# Altium project MiniFPGA.PrjPcb
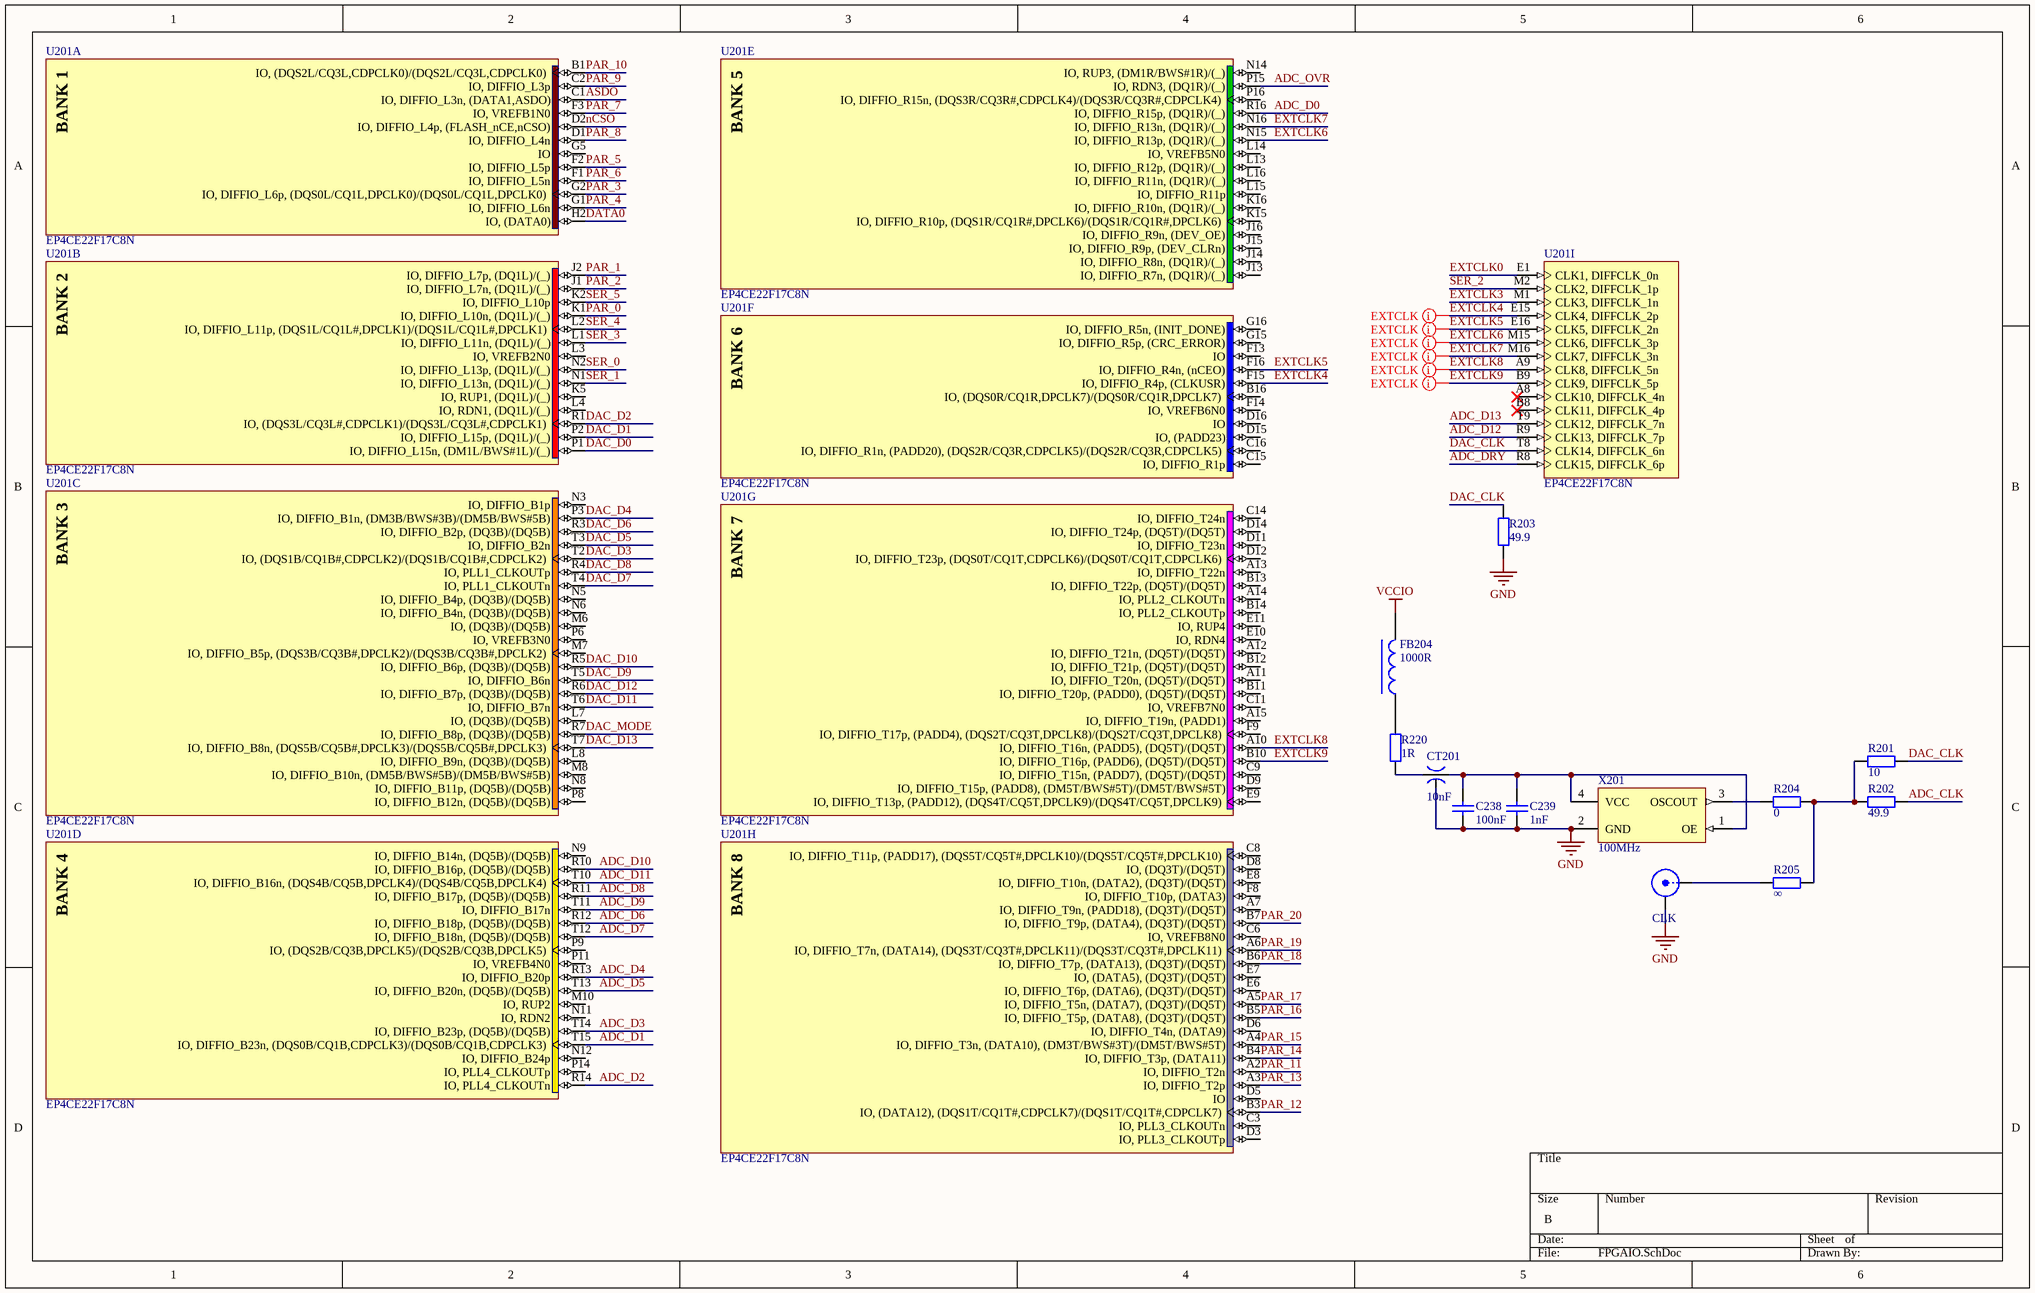
[diagram p0: FPGAIO.SchDoc]
6 sheets, 314 parts. Net scope: global (net labels, ports and power ports of the same name join across sheets).
Board file: MiniFPGA.PcbDoc
Sheets:
  FPGAIO.SchDoc
  FPGAPowerConfig.SchDoc
  ADC.SchDoc
  DAC.SchDoc
  Ports.SchDoc
  Power.SchDoc

## Sheet FPGAIO.SchDoc
size B

### Parts
C238  value 100nF  [0402C]  (hidden comment: MLCC)
C239  value 1nF  [0402C]  (hidden comment: MLCC)
CLK  SMA  [SMA-V-NARROW]  (value not drawn)
CT201  value 10nF  [CAPC0603TH]  (hidden comment: CAP-TH)
FB204  value 1000R  [0603L]  (hidden comment: FerriteBead)
R201  value 10  [0402R]  (hidden comment: Resistor)
R202  value 49.9  [0402R]  (hidden comment: Resistor)
R203  value 49.9  [0402R]  (hidden comment: Resistor)
R204  value 0  [0402R]  (hidden comment: Resistor)
R205  value ∞  [0402R]  (hidden comment: Resistor)
R220  value 1R  [0603R]  (hidden comment: Resistor)
U201  EP4CE22F17C8N  [FBGA256_A-155]  (parts A,B,C,D,E,F,G,H,I of 13)
X201  value 100MHz  [XTAL-7050]  (hidden comment: Oscillator)

### Nets
GND: C238.1 C239.1 CLK.2(Y) CT201.3 R203.1 X201.2(GND)
VCCIO: FB204.2
ADC_CLK: R202.2
ADC_D0: U201.R16(IO,_DIFFIO_R15p,_(DQ1R)/(_))
ADC_D1: U201.T15(IO,_DIFFIO_B23n,_(DQS0B/CQ1B,CDPCLK3)/(DQS0B/CQ1B,CDPCLK3))
ADC_D2: U201.R14(IO,_PLL4_CLKOUTn)
ADC_D3: U201.T14(IO,_DIFFIO_B23p,_(DQ5B)/(DQ5B))
ADC_D4: U201.R13(IO,_DIFFIO_B20p)
ADC_D5: U201.T13(IO,_DIFFIO_B20n,_(DQ5B)/(DQ5B))
ADC_D6: U201.R12(IO,_DIFFIO_B18p,_(DQ5B)/(DQ5B))
ADC_D7: U201.T12(IO,_DIFFIO_B18n,_(DQ5B)/(DQ5B))
ADC_D8: U201.R11(IO,_DIFFIO_B17p,_(DQ5B)/(DQ5B))
ADC_D9: U201.T11(IO,_DIFFIO_B17n)
ADC_D10: U201.R10(IO,_DIFFIO_B16p,_(DQ5B)/(DQ5B))
ADC_D11: U201.T10(IO,_DIFFIO_B16n,_(DQS4B/CQ5B,DPCLK4)/(DQS4B/CQ5B,DPCLK4))
ADC_D12: U201.R9(CLK13,_DIFFCLK_7p)
ADC_D13: U201.T9(CLK12,_DIFFCLK_7n)
ADC_DRY: U201.R8(CLK15,_DIFFCLK_6p)
ADC_OVR: U201.P15(IO,_RDN3,_(DQ1R)/(_))
ASDO: U201.C1(IO,_DIFFIO_L3n,_(DATA1,ASDO))
DAC_CLK: R201.2 R203.2 U201.T8(CLK14,_DIFFCLK_6n)
DAC_D0: U201.P1(IO,_DIFFIO_L15n,_(DM1L/BWS#1L)/(_))
DAC_D1: U201.P2(IO,_DIFFIO_L15p,_(DQ1L)/(_))
DAC_D2: U201.R1(IO,_(DQS3L/CQ3L#,CDPCLK1)/(DQS3L/CQ3L#,CDPCLK1))
DAC_D3: U201.T2(IO,_(DQS1B/CQ1B#,CDPCLK2)/(DQS1B/CQ1B#,CDPCLK2))
DAC_D4: U201.P3(IO,_DIFFIO_B1n,_(DM3B/BWS#3B)/(DM5B/BWS#5B))
DAC_D5: U201.T3(IO,_DIFFIO_B2n)
DAC_D6: U201.R3(IO,_DIFFIO_B2p,_(DQ3B)/(DQ5B))
DAC_D7: U201.T4(IO,_PLL1_CLKOUTn)
DAC_D8: U201.R4(IO,_PLL1_CLKOUTp)
DAC_D9: U201.T5(IO,_DIFFIO_B6n)
DAC_D10: U201.R5(IO,_DIFFIO_B6p,_(DQ3B)/(DQ5B))
DAC_D11: U201.T6(IO,_DIFFIO_B7n)
DAC_D12: U201.R6(IO,_DIFFIO_B7p,_(DQ3B)/(DQ5B))
DAC_D13: U201.T7(IO,_DIFFIO_B8n,_(DQS5B/CQ5B#,DPCLK3)/(DQS5B/CQ5B#,DPCLK3))
DAC_MODE: U201.R7(IO,_DIFFIO_B8p,_(DQ3B)/(DQ5B))
DATA0: U201.H2(IO,_(DATA0))
EXTCLK0: U201.E1(CLK1,_DIFFCLK_0n)
EXTCLK3: U201.M1(CLK3,_DIFFCLK_1n)
EXTCLK4: U201.E15(CLK4,_DIFFCLK_2p) U201.F15(IO,_DIFFIO_R4p,_(CLKUSR))
EXTCLK5: U201.E16(CLK5,_DIFFCLK_2n) U201.F16(IO,_DIFFIO_R4n,_(nCEO))
EXTCLK6: U201.M15(CLK6,_DIFFCLK_3p) U201.N15(IO,_DIFFIO_R13p,_(DQ1R)/(_))
EXTCLK7: U201.M16(CLK7,_DIFFCLK_3n) U201.N16(IO,_DIFFIO_R13n,_(DQ1R)/(_))
EXTCLK8: U201.A9(CLK8,_DIFFCLK_5n) U201.A10(IO,_DIFFIO_T16n,_(PADD5),_(DQ5T)/(DQ5T))
EXTCLK9: U201.B9(CLK9,_DIFFCLK_5p) U201.B10(IO,_DIFFIO_T16p,_(PADD6),_(DQ5T)/(DQ5T))
nCSO: U201.D2(IO,_DIFFIO_L4p,_(FLASH_nCE,nCSO))
PAR_0: U201.K1(IO,_DIFFIO_L10n,_(DQ1L)/(_))
PAR_1: U201.J2(IO,_DIFFIO_L7p,_(DQ1L)/(_))
PAR_2: U201.J1(IO,_DIFFIO_L7n,_(DQ1L)/(_))
PAR_3: U201.G2(IO,_DIFFIO_L6p,_(DQS0L/CQ1L,DPCLK0)/(DQS0L/CQ1L,DPCLK0))
PAR_4: U201.G1(IO,_DIFFIO_L6n)
PAR_5: U201.F2(IO,_DIFFIO_L5p)
PAR_6: U201.F1(IO,_DIFFIO_L5n)
PAR_7: U201.F3(IO,_VREFB1N0)
PAR_8: U201.D1(IO,_DIFFIO_L4n)
PAR_9: U201.C2(IO,_DIFFIO_L3p)
PAR_10: U201.B1(IO,_(DQS2L/CQ3L,CDPCLK0)/(DQS2L/CQ3L,CDPCLK0))
PAR_11: U201.A2(IO,_DIFFIO_T2n)
PAR_12: U201.B3(IO,_(DATA12),_(DQS1T/CQ1T#,CDPCLK7)/(DQS1T/CQ1T#,CDPCLK7))
PAR_13: U201.A3(IO,_DIFFIO_T2p)
PAR_14: U201.B4(IO,_DIFFIO_T3p,_(DATA11))
PAR_15: U201.A4(IO,_DIFFIO_T3n,_(DATA10),_(DM3T/BWS#3T)/(DM5T/BWS#5T))
PAR_16: U201.B5(IO,_DIFFIO_T5p,_(DATA8),_(DQ3T)/(DQ5T))
PAR_17: U201.A5(IO,_DIFFIO_T5n,_(DATA7),_(DQ3T)/(DQ5T))
PAR_18: U201.B6(IO,_DIFFIO_T7p,_(DATA13),_(DQ3T)/(DQ5T))
PAR_19: U201.A6(IO,_DIFFIO_T7n,_(DATA14),_(DQS3T/CQ3T#,DPCLK11)/(DQS3T/CQ3T#,DPCLK11))
PAR_20: U201.B7(IO,_DIFFIO_T9p,_(DATA4),_(DQ3T)/(DQ5T))
SER_0: U201.N2(IO,_DIFFIO_L13p,_(DQ1L)/(_))
SER_1: U201.N1(IO,_DIFFIO_L13n,_(DQ1L)/(_))
SER_2: U201.M2(CLK2,_DIFFCLK_1p)
SER_3: U201.L1(IO,_DIFFIO_L11n,_(DQ1L)/(_))
SER_4: U201.L2(IO,_DIFFIO_L11p,_(DQS1L/CQ1L#,DPCLK1)/(DQS1L/CQ1L#,DPCLK1))
SER_5: U201.K2(IO,_DIFFIO_L10p)
NetC238_2: C238.2 C239.2 CT201.2 X201.1(OE) X201.4(VCC)
NetCLK_1: CLK.1(X) R205.1
NetCT201_1: CT201.1 R220.1
NetFB204_1: FB204.1 R220.2
NetR201_1: R201.1 R202.1 R204.2 R205.2
NetR204_1: R204.1 X201.3(OSCOUT)

Not connected (* = marked no-connect by the designer): U201 A7(IO,_DIFFIO_T9n,_(PADD18),_(DQ3T)/(DQ5T)) A8(CLK10,_DIFFCLK_4n)* A11(IO,_DIFFIO_T20n,_(DQ5T)/(DQ5T)) A12(IO,_DIFFIO_T21n,_(DQ5T)/(DQ5T)) A13(IO,_DIFFIO_T22n) A14(IO,_PLL2_CLKOUTn) A15(IO,_DIFFIO_T19n,_(PADD1)) B8(CLK11,_DIFFCLK_4p)* B11(IO,_DIFFIO_T20p,_(PADD0),_(DQ5T)/(DQ5T)) B12(IO,_DIFFIO_T21p,_(DQ5T)/(DQ5T)) B13(IO,_DIFFIO_T22p,_(DQ5T)/(DQ5T)) B14(IO,_PLL2_CLKOUTp) B16(IO,_(DQS0R/CQ1R,DPCLK7)/(DQS0R/CQ1R,DPCLK7)) C3(IO,_PLL3_CLKOUTn) C6(IO,_VREFB8N0) C8(IO,_DIFFIO_T11p,_(PADD17),_(DQS5T/CQ5T#,DPCLK10)/(DQS5T/CQ5T#,DPCLK10)) C9(IO,_DIFFIO_T15n,_(PADD7),_(DQ5T)/(DQ5T)) C11(IO,_VREFB7N0) C14(IO,_DIFFIO_T24n) C15(IO,_DIFFIO_R1p) C16(IO,_DIFFIO_R1n,_(PADD20),_(DQS2R/CQ3R,CDPCLK5)/(DQS2R/CQ3R,CDPCLK5)) D3(IO,_PLL3_CLKOUTp) D5(IO) D6(IO,_DIFFIO_T4n,_(DATA9)) D8(IO,_(DQ3T)/(DQ5T)) D9(IO,_DIFFIO_T15p,_(PADD8),_(DM5T/BWS#5T)/(DM5T/BWS#5T)) D11(IO,_DIFFIO_T23n) D12(IO,_DIFFIO_T23p,_(DQS0T/CQ1T,CDPCLK6)/(DQS0T/CQ1T,CDPCLK6)) D14(IO,_DIFFIO_T24p,_(DQ5T)/(DQ5T)) D15(IO,_(PADD23)) D16(IO) E6(IO,_DIFFIO_T6p,_(DATA6),_(DQ3T)/(DQ5T)) E7(IO,_(DATA5),_(DQ3T)/(DQ5T)) E8(IO,_DIFFIO_T10n,_(DATA2),_(DQ3T)/(DQ5T)) E9(IO,_DIFFIO_T13p,_(PADD12),_(DQS4T/CQ5T,DPCLK9)/(DQS4T/CQ5T,DPCLK9)) E10(IO,_RDN4) E11(IO,_RUP4) F8(IO,_DIFFIO_T10p,_(DATA3)) F9(IO,_DIFFIO_T17p,_(PADD4),_(DQS2T/CQ3T,DPCLK8)/(DQS2T/CQ3T,DPCLK8)) F13(IO) F14(IO,_VREFB6N0) G5(IO) G15(IO,_DIFFIO_R5p,_(CRC_ERROR)) G16(IO,_DIFFIO_R5n,_(INIT_DONE)) J13(IO,_DIFFIO_R7n,_(DQ1R)/(_)) J14(IO,_DIFFIO_R8n,_(DQ1R)/(_)) J15(IO,_DIFFIO_R9p,_(DEV_CLRn)) J16(IO,_DIFFIO_R9n,_(DEV_OE)) K5(IO,_RUP1,_(DQ1L)/(_)) K15(IO,_DIFFIO_R10p,_(DQS1R/CQ1R#,DPCLK6)/(DQS1R/CQ1R#,DPCLK6)) K16(IO,_DIFFIO_R10n,_(DQ1R)/(_)) L3(IO,_VREFB2N0) L4(IO,_RDN1,_(DQ1L)/(_)) L7(IO,_(DQ3B)/(DQ5B)) L8(IO,_DIFFIO_B9n,_(DQ3B)/(DQ5B)) L13(IO,_DIFFIO_R12p,_(DQ1R)/(_)) L14(IO,_VREFB5N0) L15(IO,_DIFFIO_R11p) L16(IO,_DIFFIO_R11n,_(DQ1R)/(_)) M6(IO,_(DQ3B)/(DQ5B)) M7(IO,_DIFFIO_B5p,_(DQS3B/CQ3B#,DPCLK2)/(DQS3B/CQ3B#,DPCLK2)) M8(IO,_DIFFIO_B10n,_(DM5B/BWS#5B)/(DM5B/BWS#5B)) M10(IO,_RUP2) N3(IO,_DIFFIO_B1p) N5(IO,_DIFFIO_B4p,_(DQ3B)/(DQ5B)) N6(IO,_DIFFIO_B4n,_(DQ3B)/(DQ5B)) N8(IO,_DIFFIO_B11p,_(DQ5B)/(DQ5B)) N9(IO,_DIFFIO_B14n,_(DQ5B)/(DQ5B)) N11(IO,_RDN2) N12(IO,_DIFFIO_B24p) N14(IO,_RUP3,_(DM1R/BWS#1R)/(_)) P6(IO,_VREFB3N0) P8(IO,_DIFFIO_B12n,_(DQ5B)/(DQ5B)) P9(IO,_(DQS2B/CQ3B,DPCLK5)/(DQS2B/CQ3B,DPCLK5)) P11(IO,_VREFB4N0) P14(IO,_PLL4_CLKOUTp) P16(IO,_DIFFIO_R15n,_(DQS3R/CQ3R#,CDPCLK4)/(DQS3R/CQ3R#,CDPCLK4))

### Layout directives
net class EXTCLK: EXTCLK4, EXTCLK5, EXTCLK6, EXTCLK7, EXTCLK8, EXTCLK9

### Notes on the sheet
- (in symbol EP4CE22F17C8N, part A) BANK 1
- (in symbol EP4CE22F17C8N, part B) BANK 2
- (in symbol EP4CE22F17C8N, part C) BANK 3
- (in symbol EP4CE22F17C8N, part D) BANK 4
- (in symbol EP4CE22F17C8N, part E) BANK 5
- (in symbol EP4CE22F17C8N, part F) BANK 6
- (in symbol EP4CE22F17C8N, part G) BANK 7
- (in symbol EP4CE22F17C8N, part H) BANK 8

### Library data of the parts
CLK = SMA: SMA Connector
CT201 = CAP-TH: 3-terminal capacitor
U201 = EP4CE22F17C8N: Cyclone IV Family FPGA, 1.2V Core, 153 I/O Pins, 4 PLLs, 256-Pin FBGA, Speed Grade 8, Commercial Grade, Pb-Free; Manufacturer: Altera; DatasheetVersion: ver1.6, Nov-2011; PackageVersion: ver2.0, Nov-2011; PackageReference: FBGA256_A-155; PackageDescription: 256-Pin FineLine Ball-Grid Array (FBGA) - Thin - Wire Bond - A:1.55; Code_JEDEC: MO-192-DAF-1; ComponentLink1Description: Manufacturer URL; ComponentLink1URL: http://www.altera.com/; ComponentLink2Description: Handbook; ComponentLink2URL: http://www.altera.com/literature/hb/cyclone-iv/cyclone4-handbook.pdf; ComponentLink3Description: Pinout; ComponentLink3URL: http://www.altera.com/literature/lit-dp.jsp?category=cyc%204&showspreadsheet=y; ComponentLink4Description: Package Specification; ComponentLink4URL: http://www.altera.com/devicepackaging/04R00230-03.pdf

## Sheet FPGAPowerConfig.SchDoc
size A
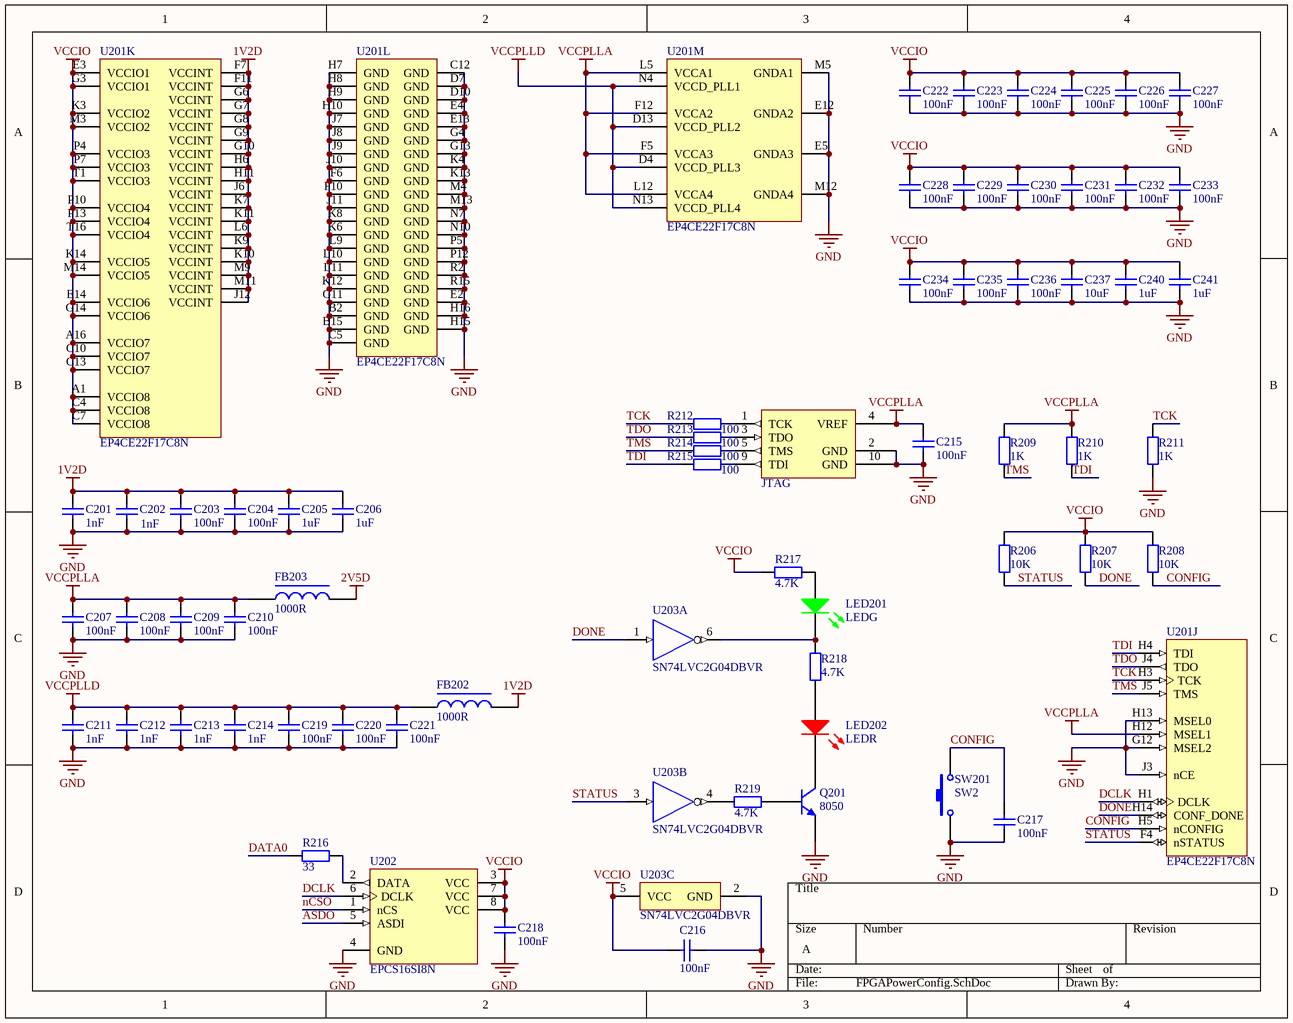
[diagram p1: FPGAPowerConfig.SchDoc]

### Parts
C201  value 1nF  [0402C]  (hidden comment: MLCC)
C202  value 1nF  [0402C]  (hidden comment: MLCC)
C203  value 100nF  [0402C]  (hidden comment: MLCC)
C204  value 100nF  [0402C]  (hidden comment: MLCC)
C205  value 1uF  [0603C]  (hidden comment: MLCC)
C206  value 1uF  [0603C]  (hidden comment: MLCC)
C207  value 100nF  [0402C]  (hidden comment: MLCC)
C208  value 100nF  [0402C]  (hidden comment: MLCC)
C209  value 100nF  [0402C]  (hidden comment: MLCC)
C210  value 100nF  [0402C]  (hidden comment: MLCC)
C211  value 1nF  [0402C]  (hidden comment: MLCC)
C212  value 1nF  [0402C]  (hidden comment: MLCC)
C213  value 1nF  [0402C]  (hidden comment: MLCC)
C214  value 1nF  [0402C]  (hidden comment: MLCC)
C215  value 100nF  [0603C]  (hidden comment: MLCC)
C216  value 100nF  [0603C]  (hidden comment: MLCC)
C217  value 100nF  [0603C]  (hidden comment: MLCC)
C218  value 100nF  [0603C]  (hidden comment: MLCC)
C219  value 100nF  [0402C]  (hidden comment: MLCC)
C220  value 100nF  [0402C]  (hidden comment: MLCC)
C221  value 100nF  [0402C]  (hidden comment: MLCC)
C222  value 100nF  [0402C]  (hidden comment: MLCC)
C223  value 100nF  [0402C]  (hidden comment: MLCC)
C224  value 100nF  [0402C]  (hidden comment: MLCC)
C225  value 100nF  [0402C]  (hidden comment: MLCC)
C226  value 100nF  [0402C]  (hidden comment: MLCC)
C227  value 100nF  [0402C]  (hidden comment: MLCC)
C228  value 100nF  [0402C]  (hidden comment: MLCC)
C229  value 100nF  [0402C]  (hidden comment: MLCC)
C230  value 100nF  [0402C]  (hidden comment: MLCC)
C231  value 100nF  [0402C]  (hidden comment: MLCC)
C232  value 100nF  [0402C]  (hidden comment: MLCC)
C233  value 100nF  [0402C]  (hidden comment: MLCC)
C234  value 100nF  [0402C]  (hidden comment: MLCC)
C235  value 100nF  [0402C]  (hidden comment: MLCC)
C236  value 100nF  [0402C]  (hidden comment: MLCC)
C237  value 10uF  [0805C]  (hidden comment: MLCC)
C240  value 1uF  [0603C]  (hidden comment: MLCC)
C241  value 1uF  [0603C]  (hidden comment: MLCC)
FB202  value 1000R  [0603L]  (hidden comment: FerriteBead)
FB203  value 1000R  [0603L]  (hidden comment: FerriteBead)
JTAG  JTAG_ALTERA  [JTAG10]  (value not drawn)
LED201  LEDG  [LED1206G]
LED202  LEDR  [LED1206R]
Q201  8050  [SOT-23]
R206  value 10K  [0603R]  (hidden comment: Resistor)
R207  value 10K  [0603R]  (hidden comment: Resistor)
R208  value 10K  [0603R]  (hidden comment: Resistor)
R209  value 1K  [0603R]  (hidden comment: Resistor)
R210  value 1K  [0603R]  (hidden comment: Resistor)
R211  value 1K  [0603R]  (hidden comment: Resistor)
R212  value 100  [0603R]  (hidden comment: Resistor)
R213  value 100  [0603R]  (hidden comment: Resistor)
R214  value 100  [0603R]  (hidden comment: Resistor)
R215  value 100  [0603R]  (hidden comment: Resistor)
R216  value 33  [0603R]  (hidden comment: Resistor)
R217  value 4.7K  [0603R]  (hidden comment: Resistor)
R218  value 4.7K  [0603R]  (hidden comment: Resistor)
R219  value 4.7K  [0603R]  (hidden comment: Resistor)
SW201  SW2  [SW-SMD1]
U201  EP4CE22F17C8N  [FBGA256_A-155]  (parts J,K,L,M of 13)
U202  EPCS16SI8N  [SOIC8_N]
U203  SN74LVC2G04DBVR  [DBV0006A_N]  (parts A,B,C of 3)

### Nets
1V2D: C201.2 C202.2 C203.2 C204.2 C205.2 C206.2 FB202.2 U201.F7(VCCINT) U201.F11(VCCINT) U201.G6(VCCINT) U201.G7(VCCINT) U201.G8(VCCINT) U201.G9(VCCINT) U201.G10(VCCINT) U201.H6(VCCINT) U201.H11(VCCINT) U201.J6(VCCINT) U201.J12(VCCINT) U201.K7(VCCINT) U201.K9(VCCINT) U201.K10(VCCINT) U201.K11(VCCINT) U201.L6(VCCINT) U201.M9(VCCINT) U201.M11(VCCINT)
2V5D: FB203.2
GND: C201.1 C202.1 C203.1 C204.1 C205.1 C206.1 C207.1 C208.1 C209.1 C210.1 C211.1 C212.1 C213.1 C214.1 C215.1 C216.2 C217.1 C218.1 C219.1 C220.1 C221.1 C222.1 C223.1 C224.1 C225.1 C226.1 C227.1 C228.1 C229.1 C230.1 C231.1 C232.1 C233.1 C234.1 C235.1 C236.1 C237.1 C240.1 C241.1 JTAG.2(GND) JTAG.10(GND) Q201.2(E) R211.1 SW201.1 U201.B2(GND) U201.B15(GND) U201.C5(GND) U201.C12(GND) U201.D7(GND) U201.D10(GND) U201.E2(GND) U201.E4(GND) U201.E5(GNDA3) U201.E12(GNDA2) U201.E13(GND) U201.F6(GND) U201.F10(GND) U201.G4(GND) U201.G11(GND) U201.G12(MSEL2) U201.G13(GND) U201.H7(GND) U201.H8(GND) U201.H9(GND) U201.H10(GND) U201.H13(MSEL0) U201.H15(GND) U201.H16(GND) U201.J3(nCE) U201.J7(GND) U201.J8(GND) U201.J9(GND) U201.J10(GND) U201.J11(GND) U201.K4(GND) U201.K6(GND) U201.K8(GND) U201.K12(GND) U201.K13(GND) U201.L9(GND) U201.L10(GND) U201.L11(GND) U201.M4(GND) U201.M5(GNDA1) U201.M12(GNDA4) U201.M13(GND) U201.N7(GND) U201.N10(GND) U201.P5(GND) U201.P12(GND) U201.R2(GND) U201.R15(GND) U202.4(GND) U203.2(GND)
VCCIO: C216.1 C218.2 C222.2 C223.2 C224.2 C225.2 C226.2 C227.2 C228.2 C229.2 C230.2 C231.2 C232.2 C233.2 C234.2 C235.2 C236.2 C237.2 C240.2 C241.2 R206.2 R207.2 R208.2 R217.1 U201.A1(VCCIO8) U201.A16(VCCIO7) U201.C4(VCCIO8) U201.C7(VCCIO8) U201.C10(VCCIO7) U201.C13(VCCIO7) U201.E3(VCCIO1) U201.E14(VCCIO6) U201.G3(VCCIO1) U201.G14(VCCIO6) U201.K3(VCCIO2) U201.K14(VCCIO5) U201.M3(VCCIO2) U201.M14(VCCIO5) U201.P4(VCCIO3) U201.P7(VCCIO3) U201.P10(VCCIO4) U201.P13(VCCIO4) U201.T1(VCCIO3) U201.T16(VCCIO4) U202.3(VCC) U202.7(VCC) U202.8(VCC) U203.5(VCC)
VCCPLLA: C207.2 C208.2 C209.2 C210.2 C215.2 FB203.1 JTAG.4(VREF) R209.2 R210.2 U201.F5(VCCA3) U201.F12(VCCA2) U201.H12(MSEL1) U201.L5(VCCA1) U201.L12(VCCA4)
VCCPLLD: C211.2 C212.2 C213.2 C214.2 C219.2 C220.2 C221.2 FB202.1 U201.D4(VCCD_PLL3) U201.D13(VCCD_PLL2) U201.N4(VCCD_PLL1) U201.N13(VCCD_PLL4)
ASDO: U202.5(ASDI)
CONFIG: C217.2 R208.1 SW201.2 U201.H5(nCONFIG)
DATA0: R216.1
DCLK: U201.H1(DCLK) U202.6(DCLK)
DONE: R207.1 U201.H14(CONF_DONE) U203.1(1A)
nCSO: U202.1(nCS)
STATUS: R206.1 U201.F4(nSTATUS) U203.3(2A)
TCK: R211.2 R212.1 U201.H3(TCK)
TDI: R210.1 R215.1 U201.H4(TDI)
TDO: R213.1 U201.J4(TDO)
TMS: R209.1 R214.1 U201.J5(TMS)
NetJTAG_1: JTAG.1(TCK) R212.2
NetJTAG_3: JTAG.3(TDO) R213.2
NetJTAG_5: JTAG.5(TMS) R214.2
NetJTAG_9: JTAG.9(TDI) R215.2
NetLED201_1: LED201.1(A) R217.2
NetLED201_2: LED201.2(K) R218.2 U203.6(1Y)
NetLED202_1: LED202.1(A) R218.1
NetLED202_2: LED202.2(K) Q201.3(C)
NetQ201_1: Q201.1(B) R219.2
NetR216_2: R216.2 U202.2(DATA)
NetR219_1: R219.1 U203.4(2Y)

### Library data of the parts
JTAG = JTAG_ALTERA: ALTERA JTAG port
LED201 = LEDG: GREEN LED
LED202 = LEDR: RED LED
Q201 = 8050: NPN Bipolar Transistor
SW201 = SW2: Switch
U201 = EP4CE22F17C8N: as U201 on sheet FPGAIO; DatasheetVersion: ver1.6, Nov-2011; PackageVersion: ver2.0, Nov-2011; PackageReference: FBGA256_A-155; PackageDescription: 256-Pin FineLine Ball-Grid Array (FBGA) - Thin - Wire Bond - A:1.55; Code_JEDEC: MO-192-DAF-1; ComponentLink1Description: Manufacturer URL; ComponentLink1URL: http://www.altera.com/; ComponentLink2Description: Handbook; ComponentLink2URL: http://www.altera.com/literature/hb/cyclone-iv/cyclone4-handbook.pdf; ComponentLink3Description: Pinout; ComponentLink3URL: http://www.altera.com/literature/lit-dp.jsp?category=cyc%204&showspreadsheet=y; ComponentLink4Description: Package Specification; ComponentLink4URL: http://www.altera.com/devicepackaging/04R00230-03.pdf
U202 = EPCS16SI8N: EPCS16 Series, In-system programmable 3.3V serial configuration device, 8-Pin SOIC, 16-Megabit, Industrial Grade, Pb-Free; Configures: All Arria series, all Cyclone series and all Stratix series (except Stratix); DatasheetVersion: ver3.0, Dec-2009; PackageVersion: ver14.2, Oct-2005; PackageReference: SOIC8; PackageDescription: 8-Pin Small Outline Integrated Circuit Package (SOIC8); Code_JEDEC: MS-012-AA; Code_IPC: SOIC127P600-8; ComponentLink1Description: Manufacturer URL; ComponentLink1URL: http://www.altera.com/; ComponentLink2Description: Configuration Handbook; ComponentLink2URL: http://www.altera.com/literature/hb/cfg/config_handbook.pdf; ComponentLink3Description: Pinout; ComponentLink3URL: http://www.altera.com/literature/hb/cfg/config_handbook.pdf; ComponentLink4Description: Package Specification; ComponentLink4URL: http://www.altera.com/support/devices/packaging/specifications/pkg-pin/pdf/016-SOIC.pdf
U203 = SN74LVC2G04DBVR: Dual Inverter, DBV0006A, LARGE T&R; Manufacturer: Texas Instruments; VCC(Min)(V): 1.65; VCC(Max)(V): 5.5; Output Type: CMOS; ICC @ Nom Voltage(Max)(mA): 0.01; Input Type: CMOS/TTL; Bits(#): 2; F @ Nom Voltage(Max)(Mhz): 150; Rating: Catalog; Technology Family: LVC; Voltage(Nom)(V): 1.8,2.5,3.3,5; Schmitt Trigger: No; Output Drive (IOL/IOH)(Max)(mA): 32/-32; tpd @ Nom Voltage(Max)(ns): 8,4.9,4.6,3.7; Logic: Inverting; Sub-Family: Inverting Buffer/Driver; DatasheetVersion: SCES195M; PackageReference: DBV0006A; Supplier 1: Mouser; Supplier Part Number 1: 595-SN74LVC2G04DBVR; Supplier 2: Digi-Key; Supplier Part Number 2: 296-13261-2-ND; Supplier 3: Digi-Key; Supplier Part Number 3: 296-13261-1-ND; Supplier 4: Digi-Key; Supplier Part Number 4: 296-13261-6-ND; Generic Part Number: SN74LVC2G04; Operating Temperature Range(C): -40 to 125; 3-State Output: No; PartNumber: SN74LVC2G04DBVR; ComponentLink1Description: Manufacturer URL; ComponentLink1URL: http://www.ti.com/; ComponentLink2Description: Datasheet; ComponentLink2URL: http://www.ti.com/lit/ds/symlink/sn74lvc2g04.pdf

## Sheet ADC.SchDoc
size A
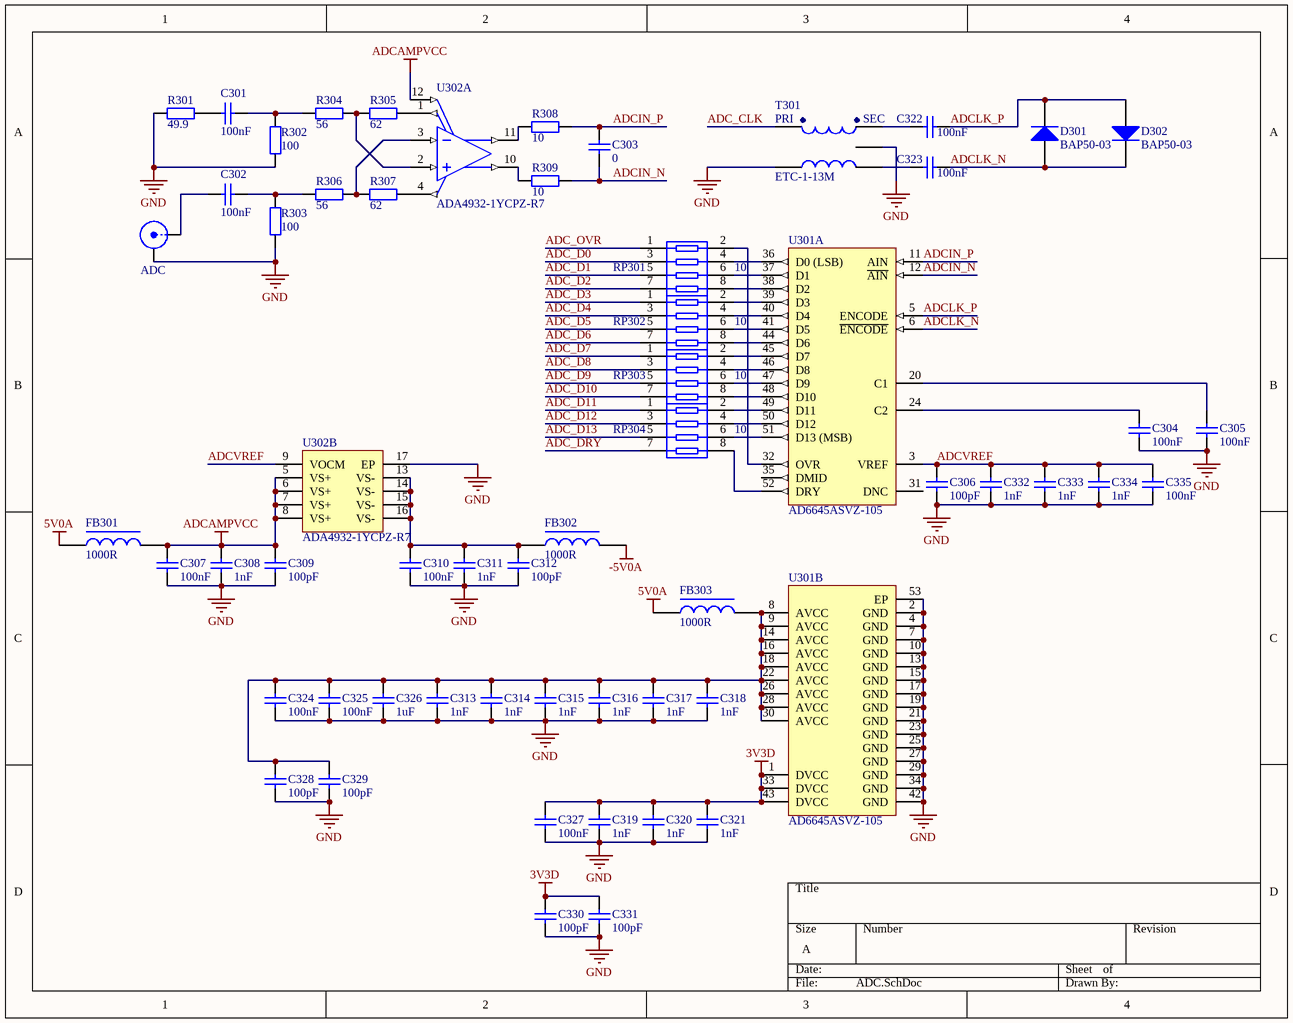
[diagram p2: ADC.SchDoc]

### Parts
ADC  SMA  [SMA-V]  (value not drawn)
C301  value 100nF  [0402C]  (hidden comment: MLCC)
C302  value 100nF  [0402C]  (hidden comment: MLCC)
C303  value 0  [0402C]  (hidden comment: MLCC)
C304  value 100nF  [0402C]  (hidden comment: MLCC)
C305  value 100nF  [0402C]  (hidden comment: MLCC)
C306  value 100pF  [0402C]  (hidden comment: MLCC)
C307  value 100nF  [0603C]  (hidden comment: MLCC)
C308  value 1nF  [0402C]  (hidden comment: MLCC)
C309  value 100pF  [0402C]  (hidden comment: MLCC)
C310  value 100nF  [0603C]  (hidden comment: MLCC)
C311  value 1nF  [0402C]  (hidden comment: MLCC)
C312  value 100pF  [0402C]  (hidden comment: MLCC)
C313  value 1nF  [0402C]  (hidden comment: MLCC)
C314  value 1nF  [0402C]  (hidden comment: MLCC)
C315  value 1nF  [0402C]  (hidden comment: MLCC)
C316  value 1nF  [0402C]  (hidden comment: MLCC)
C317  value 1nF  [0402C]  (hidden comment: MLCC)
C318  value 1nF  [0402C]  (hidden comment: MLCC)
C319  value 1nF  [0402C]  (hidden comment: MLCC)
C320  value 1nF  [0402C]  (hidden comment: MLCC)
C321  value 1nF  [0402C]  (hidden comment: MLCC)
C322  value 100nF  [0402C]  (hidden comment: MLCC)
C323  value 100nF  [0402C]  (hidden comment: MLCC)
C324  value 100nF  [0603C]  (hidden comment: MLCC)
C325  value 100nF  [0603C]  (hidden comment: MLCC)
C326  value 1uF  [0603C]  (hidden comment: MLCC)
C327  value 100nF  [0603C]  (hidden comment: MLCC)
C328  value 100pF  [0402C]  (hidden comment: MLCC)
C329  value 100pF  [0402C]  (hidden comment: MLCC)
C330  value 100pF  [0402C]  (hidden comment: MLCC)
C331  value 100pF  [0402C]  (hidden comment: MLCC)
C332  value 1nF  [0402C]  (hidden comment: MLCC)
C333  value 1nF  [0402C]  (hidden comment: MLCC)
C334  value 1nF  [0402C]  (hidden comment: MLCC)
C335  value 100nF  [0402C]  (hidden comment: MLCC)
D301  BAP50-03  [SOD323]
D302  BAP50-03  [SOD323]
FB301  value 1000R  [0603L]  (hidden comment: FerriteBead)
FB302  value 1000R  [0603L]  (hidden comment: FerriteBead)
FB303  value 1000R  [0603L]  (hidden comment: FerriteBead)
R301  value 49.9  [0402R]  (hidden comment: Resistor)
R302  value 100  [0402R]  (hidden comment: Resistor)
R303  value 100  [0402R]  (hidden comment: Resistor)
R304  value 56  [0402R]  (hidden comment: Resistor)
R305  value 62  [0402R]  (hidden comment: Resistor)
R306  value 56  [0402R]  (hidden comment: Resistor)
R307  value 62  [0402R]  (hidden comment: Resistor)
R308  value 10  [0402R]  (hidden comment: Resistor)
R309  value 10  [0402R]  (hidden comment: Resistor)
RP301  value 10  [8P4R_0402]  (hidden comment: Res Pack)
RP302  value 10  [8P4R_0402]  (hidden comment: Res Pack)
RP303  value 10  [8P4R_0402]  (hidden comment: Res Pack)
RP304  value 10  [8P4R_0402]  (hidden comment: Res Pack)
T301  ETC-1-13M  [ETC1-1-13M]
U301  AD6645ASVZ-105  [SV-52-1_N]  (parts A,B of 2)
U302  ADA4932-1YCPZ-R7  [ADI-CP-16-2_L]  (parts A,B of 2)

### Nets
3V3D: C319.2 C320.2 C321.2 C327.2 C330.2 C331.2 U301.1(DVCC) U301.33(DVCC) U301.43(DVCC)
5V0A: FB301.1 FB303.1
-5V0A: FB302.2
ADCAMPVCC: C307.2 C308.2 C309.2 FB301.2 U302.5(VS+) U302.6(VS+) U302.7(VS+) U302.8(VS+) U302.12(~{PD})
GND: ADC.2(Y) C304.1 C305.1 C306.1 C307.1 C308.1 C309.1 C310.1 C311.1 C312.1 C313.1 C314.1 C315.1 C316.1 C317.1 C318.1 C319.1 C320.1 C321.1 C324.1 C325.1 C326.1 C327.1 C328.1 C329.1 C330.1 C331.1 C332.1 C333.1 C334.1 C335.1 R301.1 R302.1 R303.1 T301.2(P) T301.4(G) U301.2(GND) U301.4(GND) U301.7(GND) U301.10(GND) U301.13(GND) U301.15(GND) U301.17(GND) U301.19(GND) U301.21(GND) U301.23(GND) U301.25(GND) U301.27(GND) U301.29(GND) U301.34(GND) U301.42(GND) U301.53(EP) U302.17(EP)
ADC_CLK: T301.1(PD)
ADC_D0: RP301.3
ADC_D1: RP301.5
ADC_D2: RP301.7
ADC_D3: RP302.1
ADC_D4: RP302.3
ADC_D5: RP302.5
ADC_D6: RP302.7
ADC_D7: RP303.1
ADC_D8: RP303.3
ADC_D9: RP303.5
ADC_D10: RP303.7
ADC_D11: RP304.1
ADC_D12: RP304.3
ADC_D13: RP304.5
ADC_DRY: RP304.7
ADC_OVR: RP301.1
ADCIN_N: C303.1 R309.2 U301.12(~{AIN})
ADCIN_P: C303.2 R308.2 U301.11(AIN)
ADCLK_N: C323.2 D301.1(A) D302.2(K) U301.6(~{ENCODE})
ADCLK_P: C322.2 D301.2(K) D302.1(A) U301.5(ENCODE)
ADCVREF: C306.2 C332.2 C333.2 C334.2 C335.2 U301.3(VREF) U302.9(VOCM)
NetADC_1: ADC.1(X) C302.1
NetC301_1: C301.1 R301.2
NetC301_2: C301.2 R302.2 R304.1
NetC302_2: C302.2 R303.2 R306.1
NetC304_2: C304.2 U301.24(C2)
NetC305_2: C305.2 U301.20(C1)
NetC310_2: C310.2 C311.2 C312.2 FB302.1 U302.13(VS-) U302.14(VS-) U302.15(VS-) U302.16(VS-)
NetC313_2: C313.2 C314.2 C315.2 C316.2 C317.2 C318.2 C324.2 C325.2 C326.2 C328.2 C329.2 FB303.2 U301.8(AVCC) U301.9(AVCC) U301.14(AVCC) U301.16(AVCC) U301.18(AVCC) U301.22(AVCC) U301.26(AVCC) U301.28(AVCC) U301.30(AVCC)
NetC322_1: C322.1 T301.5(SD)
NetC323_1: C323.1 T301.3(S)
NetR304_2: R304.2 R305.1 U302.2(IN+)
NetR305_2: R305.2 U302.1(FB-)
NetR306_2: R306.2 R307.1 U302.3(IN-)
NetR307_2: R307.2 U302.4(FB+)
NetR308_1: R308.1 U302.11(OUT-)
NetR309_1: R309.1 U302.10(OUT+)
NetRP301_2: RP301.2 U301.32(OVR)
NetRP301_4: RP301.4 U301.36(D0_(LSB))
NetRP301_6: RP301.6 U301.37(D1)
NetRP301_8: RP301.8 U301.38(D2)
NetRP302_2: RP302.2 U301.39(D3)
NetRP302_4: RP302.4 U301.40(D4)
NetRP302_6: RP302.6 U301.41(D5)
NetRP302_8: RP302.8 U301.44(D6)
NetRP303_2: RP303.2 U301.45(D7)
NetRP303_4: RP303.4 U301.46(D8)
NetRP303_6: RP303.6 U301.47(D9)
NetRP303_8: RP303.8 U301.48(D10)
NetRP304_2: RP304.2 U301.49(D11)
NetRP304_4: RP304.4 U301.50(D12)
NetRP304_6: RP304.6 U301.51(D13_(MSB))
NetRP304_8: RP304.8 U301.52(DRY)

Not connected (* = marked no-connect by the designer): U301 31(DNC) 35(DMID)

### Notes on the sheet
- (in symbol ETC-1-13M) PRI; SEC

### Library data of the parts
ADC = SMA: SMA Connector
D301 D302 = BAP50-03: Silicon PIN diode
RP301-RP304 = Res Pack: Isolated Resistor Network
T301 = ETC-1-13M: RF balun
U301 = AD6645ASVZ-105: Single 14-Bit Analog-to-Digital Converter with Parallel Interface, 105MSPS, 0 to +70 degC, SV-52-1, Pb-Free, Tray; Generic Part Number: AD6645-105; Manufacturer: Analog Devices; Resolution (Bits): 14; Channels: 1; Throughput Rate (SPS): 105M; Interface: Par; DatasheetVersion: Rev.D; PackageVersion: 072408-A; PackageReference: SV-52-1; PackageDescription: 52-Lead Thin Quad Flat Package, Exposed Pad [TQFP_EP]; Supplier 1: Digi-Key; Supplier Part Number 1: AD6645ASVZ-105-ND; Supplier 2: Farnell; Supplier Part Number 2: 2305547; Supplier 3: Newark; Supplier Part Number 3: 45P6461; Supplier 4: Mouser; Supplier Part Number 4: 584-AD6645ASVZ-105; RoHS: Y; Packing: Tray; Mounting Technology: Surface Mount; Code_JEDEC: MS-026-ACC; PartNumber: AD6645ASVZ-105; ComponentLink1Description: Manufacturer URL; ComponentLink1URL: http://www.analog.com/en/index.html; ComponentLink2Description: Datasheet; ComponentLink2URL: http://www.analog.com/static/imported-files/data_sheets/AD6645.pdf; ComponentLink3Description: Package Specification; ComponentLink3URL: SV-52-1; ComponentLink4Description: Product URL; ComponentLink4URL: http://www.analog.com/en/analog-to-digital-converters/ad-converters/ad6645/products/product.html
U302 = ADA4932-1YCPZ: Low Power Differential ADC Driver, 3 V to +/- 5 V, 9.6 mA per Amplifier, -40 to 105 degC, 16-Pin QFN (CP-16-2), RoHS, Reel; Manufacturer: Analog Devices; Slew Rate: 2800 V/us; Low Harmonic Distortion: 90 dB SFDR at 20 MHz; PackageDescription: 16-Pin Lead Frame Chip Scale Package, Body 3 x 3 mm, Pitch 0.5 mm; ComponentLink2URL: http://www.analog.com/static/imported-files/data_sheets/ADA4932-1_4932-2.pdf; Mounting Technology: Surface Mount; ComponentLink3URL: http://www.analog.com/static/imported-files/packages/PKG_PDF/LFCSP(CP)/CP_16_2.pdf; PackageVersion: Jan-05; Low Power: 9.6 mA per Amplifier; Packing: Reel; ComponentLink1Description: Manufacturer URL; RoHS: TRUE; Wide Supply Range: 3 V to +/- 5 V; ComponentLink2Description: Datasheet; PartNumber: ADA4932-1YCPZ-R7; PackageReference: CP-16-2; DatasheetVersion: Rev. C; Temperature Range: -40 to 105 degC; ComponentLink1URL: http://www.analog.com/; ComponentLink3Description: Package Specification; PartId: 1

## Sheet DAC.SchDoc
size A
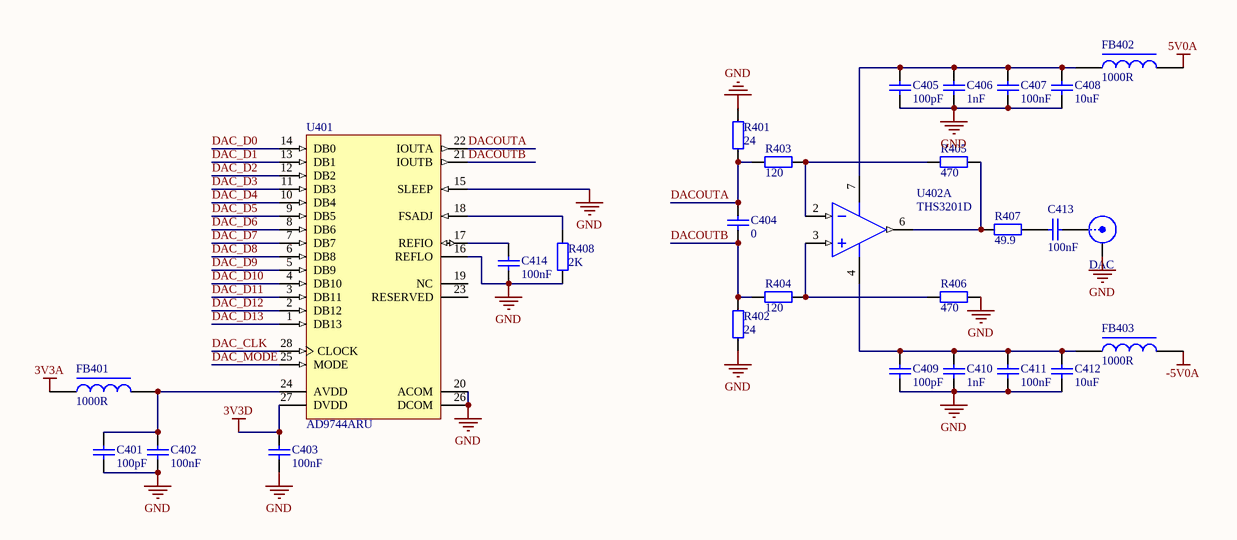
[diagram p3: DAC.SchDoc]

### Parts
C401  value 100pF  [0402C]  (hidden comment: MLCC)
C402  value 100nF  [0402C]  (hidden comment: MLCC)
C403  value 100nF  [0402C]  (hidden comment: MLCC)
C404  value 0  [0603C]  (hidden comment: MLCC)
C405  value 100pF  [0402C]  (hidden comment: MLCC)
C406  value 1nF  [0402C]  (hidden comment: MLCC)
C407  value 100nF  [0603C]  (hidden comment: MLCC)
C408  value 10uF  [0805C]  (hidden comment: MLCC)
C409  value 100pF  [0402C]  (hidden comment: MLCC)
C410  value 1nF  [0402C]  (hidden comment: MLCC)
C411  value 100nF  [0603C]  (hidden comment: MLCC)
C412  value 10uF  [0805C]  (hidden comment: MLCC)
C413  value 100nF  [0603C]  (hidden comment: MLCC)
C414  value 100nF  [0402C]  (hidden comment: MLCC)
DAC  SMA  [SMA-V]  (value not drawn)
FB401  value 1000R  [0603L]  (hidden comment: FerriteBead)
FB402  value 1000R  [0603L]  (hidden comment: FerriteBead)
FB403  value 1000R  [0603L]  (hidden comment: FerriteBead)
R401  value 24  [0603R]  (hidden comment: Resistor)
R402  value 24  [0603R]  (hidden comment: Resistor)
R403  value 120  [0603R]  (hidden comment: Resistor)
R404  value 120  [0603R]  (hidden comment: Resistor)
R405  value 470  [0603R]  (hidden comment: Resistor)
R406  value 470  [0603R]  (hidden comment: Resistor)
R407  value 49.9  [0603R]  (hidden comment: Resistor)
R408  value 2K  [0603R]  (hidden comment: Resistor)
U401  AD9744ARU  [RU-28_N]
U402  THS3201D  [D0008A_N]  (part A of 2)

### Nets
3V3A: FB401.1
3V3D: C403.2 U401.27(DVDD)
5V0A: FB402.2
-5V0A: FB403.2
GND: C401.1 C402.1 C403.1 C405.1 C406.1 C407.1 C408.1 C409.1 C410.1 C411.1 C412.1 C414.1 DAC.2(Y) R401.2 R402.1 R406.2 R408.1 U401.15(SLEEP) U401.16(REFLO) U401.20(ACOM) U401.26(DCOM)
DAC_CLK: U401.28(CLOCK)
DAC_D0: U401.14(DB0)
DAC_D1: U401.13(DB1)
DAC_D2: U401.12(DB2)
DAC_D3: U401.11(DB3)
DAC_D4: U401.10(DB4)
DAC_D5: U401.9(DB5)
DAC_D6: U401.8(DB6)
DAC_D7: U401.7(DB7)
DAC_D8: U401.6(DB8)
DAC_D9: U401.5(DB9)
DAC_D10: U401.4(DB10)
DAC_D11: U401.3(DB11)
DAC_D12: U401.2(DB12)
DAC_D13: U401.1(DB13)
DAC_MODE: U401.25(MODE)
DACOUTA: C404.2 R401.1 R403.1 U401.22(IOUTA)
DACOUTB: C404.1 R402.2 R404.1 U401.21(IOUTB)
NetC401_2: C401.2 C402.2 FB401.2 U401.24(AVDD)
NetC405_2: C405.2 C406.2 C407.2 C408.2 FB402.1 U402.7(VS+)
NetC409_2: C409.2 C410.2 C411.2 C412.2 FB403.1 U402.4(VS-)
NetC413_1: C413.1 R407.2
NetC413_2: C413.2 DAC.1(X)
NetC414_2: C414.2 U401.17(REFIO)
NetR403_2: R403.2 R405.1 U402.2(VIN-)
NetR404_2: R404.2 R406.1 U402.3(VIN+)
NetR405_2: R405.2 R407.1 U402.6(VOUT)
NetR408_2: R408.2 U401.18(FSADJ)

Not connected (* = marked no-connect by the designer): U401 19(NC) 23(RESERVED)

### Library data of the parts
DAC = SMA: SMA Connector
U401 = AD9744ARU: Single 14-Bit TxDAC, 210 Msps, -40 to +85 degC, RU-28, Tube; Generic Part Number: AD9744; Manufacturer: Analog Devices; # DAC Outputs: 1; Max V+: 3.6V; Op Pwr Diss: 145mW; Resolution (Bits): 14; Settling Time: 11ns; Single Supply: Yes; DatasheetVersion: Rev.B; PackageVersion: 2005; PackageReference: RU-28; PackageDescription: 28-Lead Thin Shrink Small Outline Package [TSSOP]; Supplier 1: Digi-Key; Supplier Part Number 1: AD9744ARU-ND; Supplier 2: Mouser; Supplier Part Number 2: 584-AD9744ARU; Packing: Tube; RoHS: N; Mounting Technology: Surface Mount; Code_JEDEC: MO-153-AE; PartNumber: AD9744ARU; ComponentLink1Description: Manufacturer URL; ComponentLink1URL: http://www.analog.com/en/index.html; ComponentLink2Description: Datasheet; ComponentLink2URL: http://www.analog.com/static/imported-files/data_sheets/AD9744.pdf; ComponentLink3Description: Package Specification; ComponentLink3URL: http://www.analog.com/static/imported-files/packages/249854663RU_28.pdf; ComponentLink4Description: Product URL; ComponentLink4URL: http://www.analog.com/en/digital-to-analog-converters/da-converters/ad9744/products/product.html
U402 = CMP-0018-00113-2: 1.8 GHz Current Feedback Amplifier, 6.6 to 15 V, -40 to 85 degC, 8-pin SOIC (D8), Green (RoHS & no Sb/Br); Manufacturer: Texas Instruments; Sub Family: High Output Current Amplifier (>=50mA), High Speed Amplifier (>=50MHz); Number of Channels: 1; Diff Phase(deg): 0.007; 2nd Harmonic(dBc): 64; Vs(Max)(V): 15; @ MHz: 10; Io(Typ)(mA): 115; Vn at Flatband(Typ)(nV/rtHz): 1.65; Iib(Max)(nA): 50000; BW @ Acl(MHz): 1800; Diff Gain(%): 0.008; Vs(Min)(V): 6.6; Slew Rate(Typ)(V/us): 6700; Vio(Max)(mV): 4; THD (Fc is 1 MHz)(Typ)(dB): -90; Settling Time (0.1%)(Typ)(ns): 20; Iq per channel(Max)(mA): 21; 3rd Harmonic(dBc): 73; PartNumber: THS3201D; PackageVersion: 4040047-3/M, 06/2011; Code_JEDEC: MS-012; Mounting Technology: Surface Mount; DatasheetVersion: SLOS416C; Acl, min stable gain(V/V): 1; ComponentLink2URL: http://www.ti.com/general/docs/lit/getliterature.tsp?genericPartNumber=THS3201&fileType=pdf; ComponentLink1URL: http://www.ti.com/; ComponentLink1Description: Manufacturer URL; PackageDescription: 8-Pin Plastic Small Outline, Body 4.9 x 3.9 mm, Pitch 1.27 mm; ComponentLink2Description: Datasheet; ComponentLink3Description: Package Specification; Eco-Plan: Green (RoHS & no Sb/Br); PackageReference: D0008A; ComponentLink3URL: http://www.ti.com/litv/pdf/msoi002j; PartId: 1

## Sheet Ports.SchDoc
size A
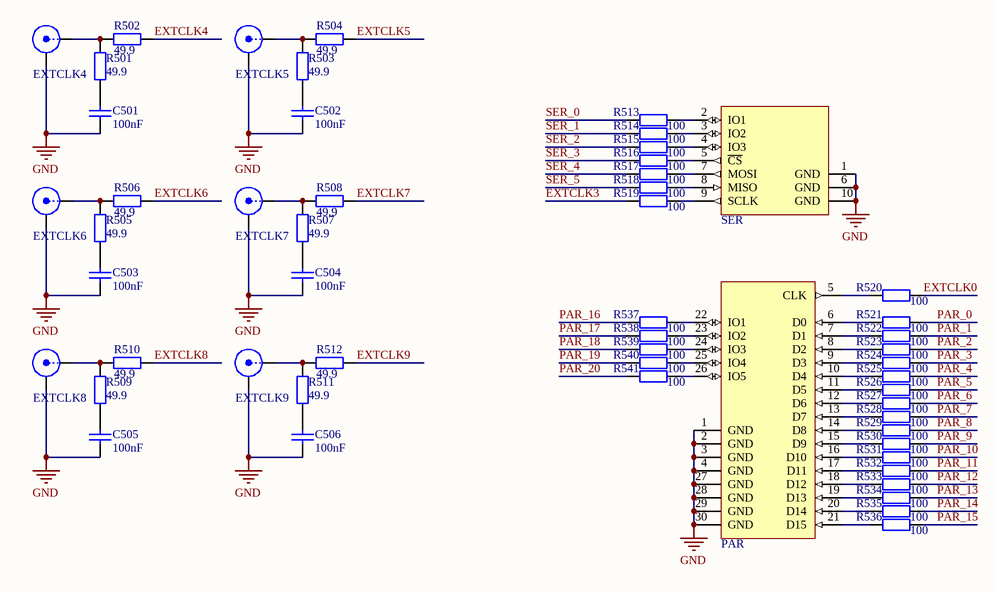
[diagram p4: Ports.SchDoc]

### Parts
C501  value 100nF  [0603C]  (hidden comment: MLCC)
C502  value 100nF  [0603C]  (hidden comment: MLCC)
C503  value 100nF  [0603C]  (hidden comment: MLCC)
C504  value 100nF  [0603C]  (hidden comment: MLCC)
C505  value 100nF  [0603C]  (hidden comment: MLCC)
C506  value 100nF  [0603C]  (hidden comment: MLCC)
EXTCLK4  SMA  [SMA-V-NARROW]  (value not drawn)
EXTCLK5  SMA  [SMA-V-NARROW]  (value not drawn)
EXTCLK6  SMA  [SMA-V-NARROW]  (value not drawn)
EXTCLK7  SMA  [SMA-V-NARROW]  (value not drawn)
EXTCLK8  SMA  [SMA-V-NARROW]  (value not drawn)
EXTCLK9  SMA  [SMA-V-NARROW]  (value not drawn)
PAR  FPGA_PAR_SLAVE  [IDC30]  (value not drawn)
R501  value 49.9  [0603R]  (hidden comment: Resistor)
R502  value 49.9  [0603R]  (hidden comment: Resistor)
R503  value 49.9  [0603R]  (hidden comment: Resistor)
R504  value 49.9  [0603R]  (hidden comment: Resistor)
R505  value 49.9  [0603R]  (hidden comment: Resistor)
R506  value 49.9  [0603R]  (hidden comment: Resistor)
R507  value 49.9  [0603R]  (hidden comment: Resistor)
R508  value 49.9  [0603R]  (hidden comment: Resistor)
R509  value 49.9  [0603R]  (hidden comment: Resistor)
R510  value 49.9  [0603R]  (hidden comment: Resistor)
R511  value 49.9  [0603R]  (hidden comment: Resistor)
R512  value 49.9  [0603R]  (hidden comment: Resistor)
R513  value 100  [0603R]  (hidden comment: Resistor)
R514  value 100  [0603R]  (hidden comment: Resistor)
R515  value 100  [0603R]  (hidden comment: Resistor)
R516  value 100  [0603R]  (hidden comment: Resistor)
R517  value 100  [0603R]  (hidden comment: Resistor)
R518  value 100  [0603R]  (hidden comment: Resistor)
R519  value 100  [0603R]  (hidden comment: Resistor)
R520  value 100  [0603R]  (hidden comment: Resistor)
R521  value 100  [0603R]  (hidden comment: Resistor)
R522  value 100  [0603R]  (hidden comment: Resistor)
R523  value 100  [0603R]  (hidden comment: Resistor)
R524  value 100  [0603R]  (hidden comment: Resistor)
R525  value 100  [0603R]  (hidden comment: Resistor)
R526  value 100  [0603R]  (hidden comment: Resistor)
R527  value 100  [0603R]  (hidden comment: Resistor)
R528  value 100  [0603R]  (hidden comment: Resistor)
R529  value 100  [0603R]  (hidden comment: Resistor)
R530  value 100  [0603R]  (hidden comment: Resistor)
R531  value 100  [0603R]  (hidden comment: Resistor)
R532  value 100  [0603R]  (hidden comment: Resistor)
R533  value 100  [0603R]  (hidden comment: Resistor)
R534  value 100  [0603R]  (hidden comment: Resistor)
R535  value 100  [0603R]  (hidden comment: Resistor)
R536  value 100  [0603R]  (hidden comment: Resistor)
R537  value 100  [0603R]  (hidden comment: Resistor)
R538  value 100  [0603R]  (hidden comment: Resistor)
R539  value 100  [0603R]  (hidden comment: Resistor)
R540  value 100  [0603R]  (hidden comment: Resistor)
R541  value 100  [0603R]  (hidden comment: Resistor)
SER  FPGA_SER_SLAVE  [IDC10]  (value not drawn)

### Nets
GND: C501.1 C502.1 C503.1 C504.1 C505.1 C506.1 EXTCLK4.2(Y) EXTCLK5.2(Y) EXTCLK6.2(Y) EXTCLK7.2(Y) EXTCLK8.2(Y) EXTCLK9.2(Y) PAR.1(GND) PAR.2(GND) PAR.3(GND) PAR.4(GND) PAR.27(GND) PAR.28(GND) PAR.29(GND) PAR.30(GND) SER.1(GND) SER.6(GND) SER.10(GND)
EXTCLK0: R520.2
EXTCLK3: R519.1
EXTCLK4: R502.2
EXTCLK5: R504.2
EXTCLK6: R506.2
EXTCLK7: R508.2
EXTCLK8: R510.2
EXTCLK9: R512.2
PAR_0: R521.2
PAR_1: R522.2
PAR_2: R523.2
PAR_3: R524.2
PAR_4: R525.2
PAR_5: R526.2
PAR_6: R527.2
PAR_7: R528.2
PAR_8: R529.2
PAR_9: R530.2
PAR_10: R531.2
PAR_11: R532.2
PAR_12: R533.2
PAR_13: R534.2
PAR_14: R535.2
PAR_15: R536.2
PAR_16: R537.1
PAR_17: R538.1
PAR_18: R539.1
PAR_19: R540.1
PAR_20: R541.1
SER_0: R513.1
SER_1: R514.1
SER_2: R515.1
SER_3: R516.1
SER_4: R517.1
SER_5: R518.1
NetC501_2: C501.2 R501.1
NetC502_2: C502.2 R503.1
NetC503_2: C503.2 R505.1
NetC504_2: C504.2 R507.1
NetC505_2: C505.2 R509.1
NetC506_2: C506.2 R511.1
NetEXTCLK4_1: EXTCLK4.1(X) R501.2 R502.1
NetEXTCLK5_1: EXTCLK5.1(X) R503.2 R504.1
NetEXTCLK6_1: EXTCLK6.1(X) R505.2 R506.1
NetEXTCLK7_1: EXTCLK7.1(X) R507.2 R508.1
NetEXTCLK8_1: EXTCLK8.1(X) R509.2 R510.1
NetEXTCLK9_1: EXTCLK9.1(X) R511.2 R512.1
NetPAR_5: PAR.5(CLK) R520.1
NetPAR_6: PAR.6(D0) R521.1
NetPAR_7: PAR.7(D1) R522.1
NetPAR_8: PAR.8(D2) R523.1
NetPAR_9: PAR.9(D3) R524.1
NetPAR_10: PAR.10(D4) R525.1
NetPAR_11: PAR.11(D5) R526.1
NetPAR_12: PAR.12(D6) R527.1
NetPAR_13: PAR.13(D7) R528.1
NetPAR_14: PAR.14(D8) R529.1
NetPAR_15: PAR.15(D9) R530.1
NetPAR_16: PAR.16(D10) R531.1
NetPAR_17: PAR.17(D11) R532.1
NetPAR_18: PAR.18(D12) R533.1
NetPAR_19: PAR.19(D13) R534.1
NetPAR_20: PAR.20(D14) R535.1
NetPAR_21: PAR.21(D15) R536.1
NetPAR_22: PAR.22(IO1) R537.2
NetPAR_23: PAR.23(IO2) R538.2
NetPAR_24: PAR.24(IO3) R539.2
NetPAR_25: PAR.25(IO4) R540.2
NetPAR_26: PAR.26(IO5) R541.2
NetR513_2: R513.2 SER.2(IO1)
NetR514_2: R514.2 SER.3(IO2)
NetR515_2: R515.2 SER.4(IO3)
NetR516_2: R516.2 SER.5(~{CS})
NetR517_2: R517.2 SER.7(MOSI)
NetR518_2: R518.2 SER.8(MISO)
NetR519_2: R519.2 SER.9(SCLK)

### Library data of the parts
EXTCLK4-EXTCLK9 = SMA: SMA Connector
PAR = FPGA_PAR_SLAVE: FPGA parallel port
SER = FPGA_SER_SLAVE: FPGA serial port

## Sheet Power.SchDoc
size A
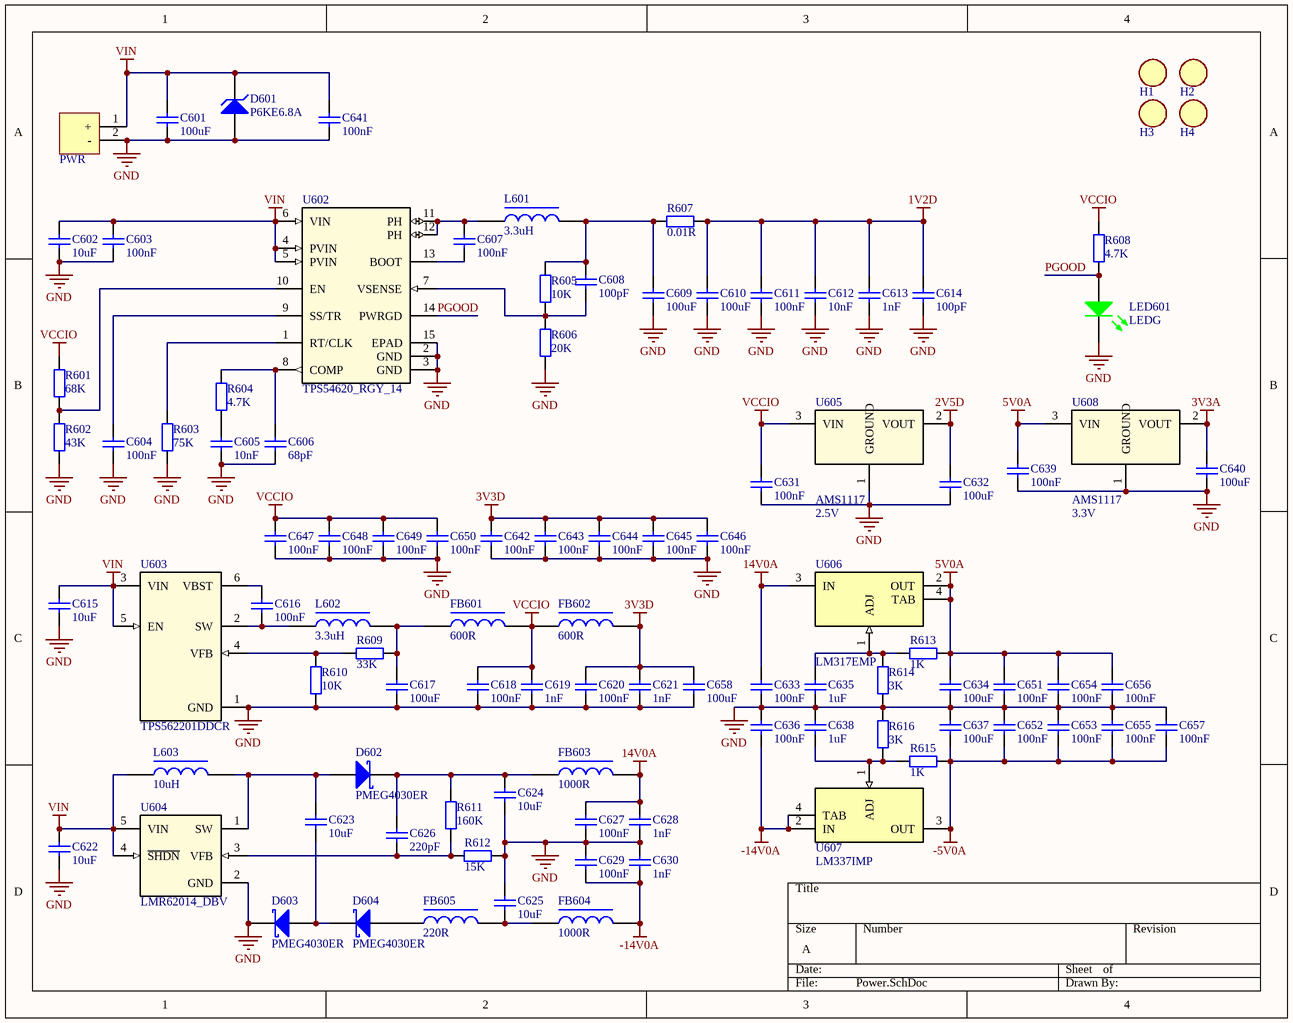
[diagram p5: Power.SchDoc]

### Parts
C601  value 100uF  [1210C]  (hidden comment: MLCC)
C602  value 10uF  [1206C]  (hidden comment: MLCC)
C603  value 100nF  [0603C]  (hidden comment: MLCC)
C604  value 100nF  [0603C]  (hidden comment: MLCC)
C605  value 10nF  [0603C]  (hidden comment: MLCC)
C606  value 68pF  [0603C]  (hidden comment: MLCC)
C607  value 100nF  [0603C]  (hidden comment: MLCC)
C608  value 100pF  [0603C]  (hidden comment: MLCC)
C609  value 100uF  [1206C]  (hidden comment: MLCC)
C610  value 100uF  [1206C]  (hidden comment: MLCC)
C611  value 100nF  [0402C]  (hidden comment: MLCC)
C612  value 10nF  [0402C]  (hidden comment: MLCC)
C613  value 1nF  [0402C]  (hidden comment: MLCC)
C614  value 100pF  [0402C]  (hidden comment: MLCC)
C615  value 10uF  [1206C]  (hidden comment: MLCC)
C616  value 100nF  [0603C]  (hidden comment: MLCC)
C617  value 100uF  [1206C]  (hidden comment: MLCC)
C618  value 100nF  [0402C]  (hidden comment: MLCC)
C619  value 1nF  [0402C]  (hidden comment: MLCC)
C620  value 100nF  [0402C]  (hidden comment: MLCC)
C621  value 1nF  [0402C]  (hidden comment: MLCC)
C622  value 10uF  [1206C]  (hidden comment: MLCC)
C623  value 10uF  [1206C]  (hidden comment: MLCC)
C624  value 10uF  [1206C]  (hidden comment: MLCC)
C625  value 10uF  [1206C]  (hidden comment: MLCC)
C626  value 220pF  [0603C]  (hidden comment: MLCC)
C627  value 100nF  [0402C]  (hidden comment: MLCC)
C628  value 1nF  [0402C]  (hidden comment: MLCC)
C629  value 100nF  [0402C]  (hidden comment: MLCC)
C630  value 1nF  [0402C]  (hidden comment: MLCC)
C631  value 100nF  [0603C]  (hidden comment: MLCC)
C632  value 100uF  [1206C]  (hidden comment: MLCC)
C633  value 100nF  [0603C]  (hidden comment: MLCC)
C634  value 100uF  [1206C]  (hidden comment: MLCC)
C635  value 1uF  [0805C]  (hidden comment: MLCC)
C636  value 100nF  [0603C]  (hidden comment: MLCC)
C637  value 100uF  [1206C]  (hidden comment: MLCC)
C638  value 1uF  [0805C]  (hidden comment: MLCC)
C639  value 100nF  [0603C]  (hidden comment: MLCC)
C640  value 100uF  [1206C]  (hidden comment: MLCC)
C641  value 100nF  [0603C]  (hidden comment: MLCC)
C642  value 100nF  [0603C]  (hidden comment: MLCC)
C643  value 100nF  [0603C]  (hidden comment: MLCC)
C644  value 100nF  [0603C]  (hidden comment: MLCC)
C645  value 100nF  [0603C]  (hidden comment: MLCC)
C646  value 100nF  [0603C]  (hidden comment: MLCC)
C647  value 100nF  [0603C]  (hidden comment: MLCC)
C648  value 100nF  [0603C]  (hidden comment: MLCC)
C649  value 100nF  [0603C]  (hidden comment: MLCC)
C650  value 100nF  [0603C]  (hidden comment: MLCC)
C651  value 100nF  [0603C]  (hidden comment: MLCC)
C652  value 100nF  [0603C]  (hidden comment: MLCC)
C653  value 100nF  [0603C]  (hidden comment: MLCC)
C654  value 100nF  [0603C]  (hidden comment: MLCC)
C655  value 100nF  [0603C]  (hidden comment: MLCC)
C656  value 100nF  [0603C]  (hidden comment: MLCC)
C657  value 100nF  [0603C]  (hidden comment: MLCC)
C658  value 100uF  [1206C]  (hidden comment: MLCC)
D601  P6KE6.8A  [SMB]
D602  PMEG4030ER  [SOD123]
D603  PMEG4030ER  [SOD123]
D604  PMEG4030ER  [SOD123]
FB601  value 600R  [1206L]  (hidden comment: FerriteBead)
FB602  value 600R  [1206L]  (hidden comment: FerriteBead)
FB603  value 1000R  [0805L]  (hidden comment: FerriteBead)
FB604  value 1000R  [0805L]  (hidden comment: FerriteBead)
FB605  value 220R  [0805L]  (hidden comment: FerriteBead)
H1  MountHole  [MOUNTHOLE]  (value not drawn)
H2  MountHole  [MOUNTHOLE]  (value not drawn)
H3  MountHole  [MOUNTHOLE]  (value not drawn)
H4  MountHole  [MOUNTHOLE]  (value not drawn)
L601  value 3.3uH  [IND0630]  (hidden comment: PowerInductor)
L602  value 3.3uH  [IND0420]  (hidden comment: PowerInductor)
L603  value 10uH  [IND0420]  (hidden comment: PowerInductor)
LED601  LEDG  [LED1206G]
PWR  WPORT2_PWR  [VH3.96-POWER-2P]  (value not drawn)
R601  value 68K  [0603R]  (hidden comment: Resistor)
R602  value 43K  [0603R]  (hidden comment: Resistor)
R603  value 75K  [0603R]  (hidden comment: Resistor)
R604  value 4.7K  [0603R]  (hidden comment: Resistor)
R605  value 10K  [0603R]  (hidden comment: Resistor)
R606  value 20K  [0603R]  (hidden comment: Resistor)
R607  value 0.01R  [1206R]  (hidden comment: Resistor)
R608  value 4.7K  [0603R]  (hidden comment: Resistor)
R609  value 33K  [0603R]  (hidden comment: Resistor)
R610  value 10K  [0603R]  (hidden comment: Resistor)
R611  value 160K  [0603R]  (hidden comment: Resistor)
R612  value 15K  [0603R]  (hidden comment: Resistor)
R613  value 1K  [0603R]  (hidden comment: Resistor)
R614  value 3K  [0603R]  (hidden comment: Resistor)
R615  value 1K  [0603R]  (hidden comment: Resistor)
R616  value 3K  [0603R]  (hidden comment: Resistor)
U602  TPS54620_RGY_14  [RGY14_2P05X2P05]
U603  TPS562201DDCR  [DDC0006A_N]
U604  LMR62014_DBV  [MF05A_N]
U605  AMS1117  value 2.5V  [DCY4]
U606  LM317EMP  [MP04A_N]
U607  LM337IMP  [MP04A_N]
U608  AMS1117  value 3.3V  [DCY4]

### Nets
1V2D: C610.2 C611.2 C612.2 C613.2 C614.2 R607.2
2V5D: C632.2 U605.2(VOUT)
3V3A: C640.2 U608.2(VOUT)
3V3D: C620.2 C621.2 C642.2 C643.2 C644.2 C645.2 C646.2 C658.2 FB602.2
5V0A: C634.2 C639.2 C651.2 C654.2 C656.2 R613.2 U606.2(OUT) U606.4(TAB) U608.3(VIN)
14V0A: C627.2 C628.2 C633.2 FB603.2 U606.3(IN)
-5V0A: C637.1 C652.1 C653.1 C655.1 C657.1 R615.2 U607.3(OUT)
-14V0A: C629.1 C630.1 C636.1 FB604.2 U607.2(IN) U607.4(TAB)
GND: C601.1 C602.1 C603.1 C604.1 C605.1 C606.1 C609.1 C610.1 C611.1 C612.1 C613.1 C614.1 C615.1 C617.1 C618.1 C619.1 C620.1 C621.1 C622.1 C624.1 C625.2 C627.1 C628.1 C629.2 C630.2 C631.1 C632.1 C633.1 C634.1 C635.1 C636.2 C637.2 C638.2 C639.1 C640.1 C641.1 C642.1 C643.1 C644.1 C645.1 C646.1 C647.1 C648.1 C649.1 C650.1 C651.1 C652.2 C653.2 C654.1 C655.2 C656.1 C657.2 C658.1 D601.1(A) D603.2(K) LED601.2(K) PWR.2(-) R602.1 R603.1 R606.1 R610.1 R612.2 R614.1 R616.2 U602.2(GND) U602.3(GND) U602.15(EPAD) U603.1(GND) U604.2(GND) U605.1(GROUND) U608.1(GROUND)
VCCIO: C618.2 C619.2 C631.2 C647.2 C648.2 C649.2 C650.2 FB601.2 FB602.1 R601.2 R608.2 U605.3(VIN)
VIN: C601.2 C602.2 C603.2 C615.2 C622.2 C641.2 D601.2(K) L603.1 PWR.1(+) U602.4(PVIN) U602.5(PVIN) U602.6(VIN) U603.3(VIN) U603.5(EN) U604.4(~{SHDN}) U604.5(VIN)
PGOOD: LED601.1(A) R608.1 U602.14(PWRGD)
NetC604_2: C604.2 U602.9(SS/TR)
NetC605_2: C605.2 R604.1
NetC606_2: C606.2 R604.2 U602.8(COMP)
NetC607_1: C607.1 U602.13(BOOT)
NetC607_2: C607.2 L601.1 U602.11(PH) U602.12(PH)
NetC608_1: C608.1 R605.1 R606.2 U602.7(VSENSE)
NetC608_2: C608.2 C609.2 L601.2 R605.2 R607.1
NetC616_1: C616.1 L602.1 U603.2(SW)
NetC616_2: C616.2 U603.6(VBST)
NetC617_2: C617.2 FB601.1 L602.2 R609.2
NetC623_1: C623.1 D603.1(A) D604.2(K)
NetC623_2: C623.2 D602.1(A) L603.2 U604.1(SW)
NetC624_2: C624.2 C626.2 D602.2(K) FB603.1 R611.2
NetC625_1: C625.1 FB604.1 FB605.2
NetC626_1: C626.1 R611.1 R612.1 U604.3(VFB)
NetC635_2: C635.2 R613.1 R614.2 U606.1(ADJ)
NetC638_1: C638.1 R615.1 R616.1 U607.1(ADJ)
NetD604_1: D604.1(A) FB605.1
NetR601_1: R601.1 R602.2 U602.10(EN)
NetR603_2: R603.2 U602.1(RT/CLK)
NetR609_1: R609.1 R610.2 U603.4(VFB)

### Library data of the parts
D601 = P6KE6.8A: 600 Watt Peak Power Surmetict-40 Zener TransientVoltage Suppressors
D602-D604 = PMEG4030ER: 3 A low VF MEGA Schottky barrier rectifier
H1-H4 = MountHole: 3mm mount hole
L601-L603 = PowerInductor: Power Inductor
LED601 = LEDG: GREEN LED
PWR = WPORT2_PWR: 2 pin power port
U602 = TPS54620_RGY_14: Buck Step Down Regulator with 4.5 to 17 V Input and 0.8 to 15 V Output, -40 to 150 degC, 14-Pin VQFN (RGY), Green (RoHS & no Sb/Br); Vendor: Texas Instruments; PIN_COUNT: 14; FAMILY_NAME: STEP-DOWN REGULATOR; Manufacturer_Part_Number: tps54620_rgy_14; GENERIC_PART_NUMBER: TPS54620; Manufacturer: Texas Instruments; PACKAGE_DESIGNATOR: RGY; INDUSTRY_STD_PKG_TYPE: VQFN; Datasheet_URL: http://www.ti.com/lit/gpn/TPS54620; Value: Value; Type: Type; RefDes: RefDes
U603 = TPS562201DDCR: 4.5-V to 17-V Input, 2-A Synchronous Step-Down Voltage Regulator in 6-Pin SOT-23; Manufacturer: Texas Instruments; CompType: IC; PIN_COUNT: 6; Application_BuildNumber: *; PartNumber: TPS562201DDCR; PackageReference: DDC0006A; MountType: SMT; RefDes: RefDes; TYPE: TYPE; Value: Value
U604 = LMR62014_DBV: SIMPLE SWITCHER® 20Vout, 1.4A Step-Up Voltage Regulator in SOT-23; Manufacturer: Texas Instruments; CompType: IC; PIN_COUNT: 5; Application_BuildNumber: *; PartNumber: LMR62014_DBV; PackageReference: MF05A; MountType: SMT; RefDes: RefDes; TYPE: TYPE; Value: Value
U605 U608 = AMS1117: 800mA LOW DROPOUT VOLTAGE REGULATOR
U606 = LM317EMP: 3-Terminal Adjustable Regulator, 4-pin SOT-223; Manufacturer: National Semiconductor; PackageTopMarking: XYTT*N01A; PowerWise: N; CompType: LDO IC; High-Reliability: Y; DatasheetVersion: Apr-2007; PackageVersion: revB, Apr-2003; PackageReference: MP04A; PackageDescription: Molded SOT-223, 6.50 x 3.56 x 1.6mm Body, 4 Lead, 2.3mm Pitch; PartNumber: LM317EMP; RoHS: N; PinCount: 4; Code_JEDEC: TO-261-AA; Code_IPC: SOT223-4; ComponentLink1Description: Manufacturer URL; ComponentLink1URL: http://www.national.com/; ComponentLink2Description: LM317 Datasheet; ComponentLink2URL: http://www.national.com/ds/LM/LM317.pdf; ComponentLink3Description: LM317 Web Page; ComponentLink3URL: http://www.national.com/pf/LM/LM317.html; ComponentLink4Description: MP04A Package Page; ComponentLink4URL: http://www.national.com/packaging/folders/mp04a.html
U607 = LM337IMP: 3-Terminal Adjustable Negative Regulator, 4-pin SOT-223; Manufacturer: National Semiconductor; PackageTopMarking: XYTT*N02A; PowerWise: N; CompType: LDO IC; High-Reliability: Y; DatasheetVersion: Nov-2004; PackageVersion: revB, Apr-2003; PackageReference: MP04A; PackageDescription: Molded SOT-223, 6.50 x 3.56 x 1.6mm Body, 4 Lead, 2.3mm Pitch; PartNumber: LM337IMP; RoHS: N; PinCount: 4; Code_JEDEC: TO-261-AA; Code_IPC: SOT223-4; ComponentLink1Description: Manufacturer URL; ComponentLink1URL: http://www.national.com/; ComponentLink2Description: LM337 Datasheet; ComponentLink2URL: http://www.national.com/ds/LM/LM337.pdf; ComponentLink3Description: LM337 Web Page; ComponentLink3URL: http://www.national.com/pf/LM/LM337.html; ComponentLink4Description: MP04A Package Page; ComponentLink4URL: http://www.national.com/packaging/folders/mp04a.html

## Nets that join several sheets
1V2D: FPGAPowerConfig (25 pins), Power (6 pins)
2V5D: FPGAPowerConfig (FB203.2), Power (C632.2 U605.2)
3V3A: DAC (FB401.1), Power (C640.2 U608.2)
3V3D: ADC (9 pins), DAC (C403.2 U401.27), Power (9 pins)
5V0A: ADC (FB301.1 FB303.1), DAC (FB402.2), Power (9 pins)
-5V0A: ADC (FB302.2), DAC (FB403.2), Power (7 pins)
GND: FPGAIO (6 pins), FPGAPowerConfig (94 pins), ADC (53 pins), DAC (21 pins), Ports (23 pins), Power (71 pins)
VCCIO: FPGAIO (FB204.2), FPGAPowerConfig (48 pins), Power (12 pins)
ADC_CLK: FPGAIO (R202.2), ADC (T301.1)
ADC_D0: FPGAIO (U201.R16), ADC (RP301.3)
ADC_D1: FPGAIO (U201.T15), ADC (RP301.5)
ADC_D2: FPGAIO (U201.R14), ADC (RP301.7)
ADC_D3: FPGAIO (U201.T14), ADC (RP302.1)
ADC_D4: FPGAIO (U201.R13), ADC (RP302.3)
ADC_D5: FPGAIO (U201.T13), ADC (RP302.5)
ADC_D6: FPGAIO (U201.R12), ADC (RP302.7)
ADC_D7: FPGAIO (U201.T12), ADC (RP303.1)
ADC_D8: FPGAIO (U201.R11), ADC (RP303.3)
ADC_D9: FPGAIO (U201.T11), ADC (RP303.5)
ADC_D10: FPGAIO (U201.R10), ADC (RP303.7)
ADC_D11: FPGAIO (U201.T10), ADC (RP304.1)
ADC_D12: FPGAIO (U201.R9), ADC (RP304.3)
ADC_D13: FPGAIO (U201.T9), ADC (RP304.5)
ADC_DRY: FPGAIO (U201.R8), ADC (RP304.7)
ADC_OVR: FPGAIO (U201.P15), ADC (RP301.1)
ASDO: FPGAIO (U201.C1), FPGAPowerConfig (U202.5)
DAC_CLK: FPGAIO (R201.2 R203.2 U201.T8), DAC (U401.28)
DAC_D0: FPGAIO (U201.P1), DAC (U401.14)
DAC_D1: FPGAIO (U201.P2), DAC (U401.13)
DAC_D2: FPGAIO (U201.R1), DAC (U401.12)
DAC_D3: FPGAIO (U201.T2), DAC (U401.11)
DAC_D4: FPGAIO (U201.P3), DAC (U401.10)
DAC_D5: FPGAIO (U201.T3), DAC (U401.9)
DAC_D6: FPGAIO (U201.R3), DAC (U401.8)
DAC_D7: FPGAIO (U201.T4), DAC (U401.7)
DAC_D8: FPGAIO (U201.R4), DAC (U401.6)
DAC_D9: FPGAIO (U201.T5), DAC (U401.5)
DAC_D10: FPGAIO (U201.R5), DAC (U401.4)
DAC_D11: FPGAIO (U201.T6), DAC (U401.3)
DAC_D12: FPGAIO (U201.R6), DAC (U401.2)
DAC_D13: FPGAIO (U201.T7), DAC (U401.1)
DAC_MODE: FPGAIO (U201.R7), DAC (U401.25)
DATA0: FPGAIO (U201.H2), FPGAPowerConfig (R216.1)
EXTCLK0: FPGAIO (U201.E1), Ports (R520.2)
EXTCLK3: FPGAIO (U201.M1), Ports (R519.1)
EXTCLK4: FPGAIO (U201.E15 U201.F15), Ports (R502.2)
EXTCLK5: FPGAIO (U201.E16 U201.F16), Ports (R504.2)
EXTCLK6: FPGAIO (U201.M15 U201.N15), Ports (R506.2)
EXTCLK7: FPGAIO (U201.M16 U201.N16), Ports (R508.2)
EXTCLK8: FPGAIO (U201.A9 U201.A10), Ports (R510.2)
EXTCLK9: FPGAIO (U201.B9 U201.B10), Ports (R512.2)
nCSO: FPGAIO (U201.D2), FPGAPowerConfig (U202.1)
PAR_0: FPGAIO (U201.K1), Ports (R521.2)
PAR_1: FPGAIO (U201.J2), Ports (R522.2)
PAR_2: FPGAIO (U201.J1), Ports (R523.2)
PAR_3: FPGAIO (U201.G2), Ports (R524.2)
PAR_4: FPGAIO (U201.G1), Ports (R525.2)
PAR_5: FPGAIO (U201.F2), Ports (R526.2)
PAR_6: FPGAIO (U201.F1), Ports (R527.2)
PAR_7: FPGAIO (U201.F3), Ports (R528.2)
PAR_8: FPGAIO (U201.D1), Ports (R529.2)
PAR_9: FPGAIO (U201.C2), Ports (R530.2)
PAR_10: FPGAIO (U201.B1), Ports (R531.2)
PAR_11: FPGAIO (U201.A2), Ports (R532.2)
PAR_12: FPGAIO (U201.B3), Ports (R533.2)
PAR_13: FPGAIO (U201.A3), Ports (R534.2)
PAR_14: FPGAIO (U201.B4), Ports (R535.2)
PAR_15: FPGAIO (U201.A4), Ports (R536.2)
PAR_16: FPGAIO (U201.B5), Ports (R537.1)
PAR_17: FPGAIO (U201.A5), Ports (R538.1)
PAR_18: FPGAIO (U201.B6), Ports (R539.1)
PAR_19: FPGAIO (U201.A6), Ports (R540.1)
PAR_20: FPGAIO (U201.B7), Ports (R541.1)
SER_0: FPGAIO (U201.N2), Ports (R513.1)
SER_1: FPGAIO (U201.N1), Ports (R514.1)
SER_2: FPGAIO (U201.M2), Ports (R515.1)
SER_3: FPGAIO (U201.L1), Ports (R516.1)
SER_4: FPGAIO (U201.L2), Ports (R517.1)
SER_5: FPGAIO (U201.K2), Ports (R518.1)